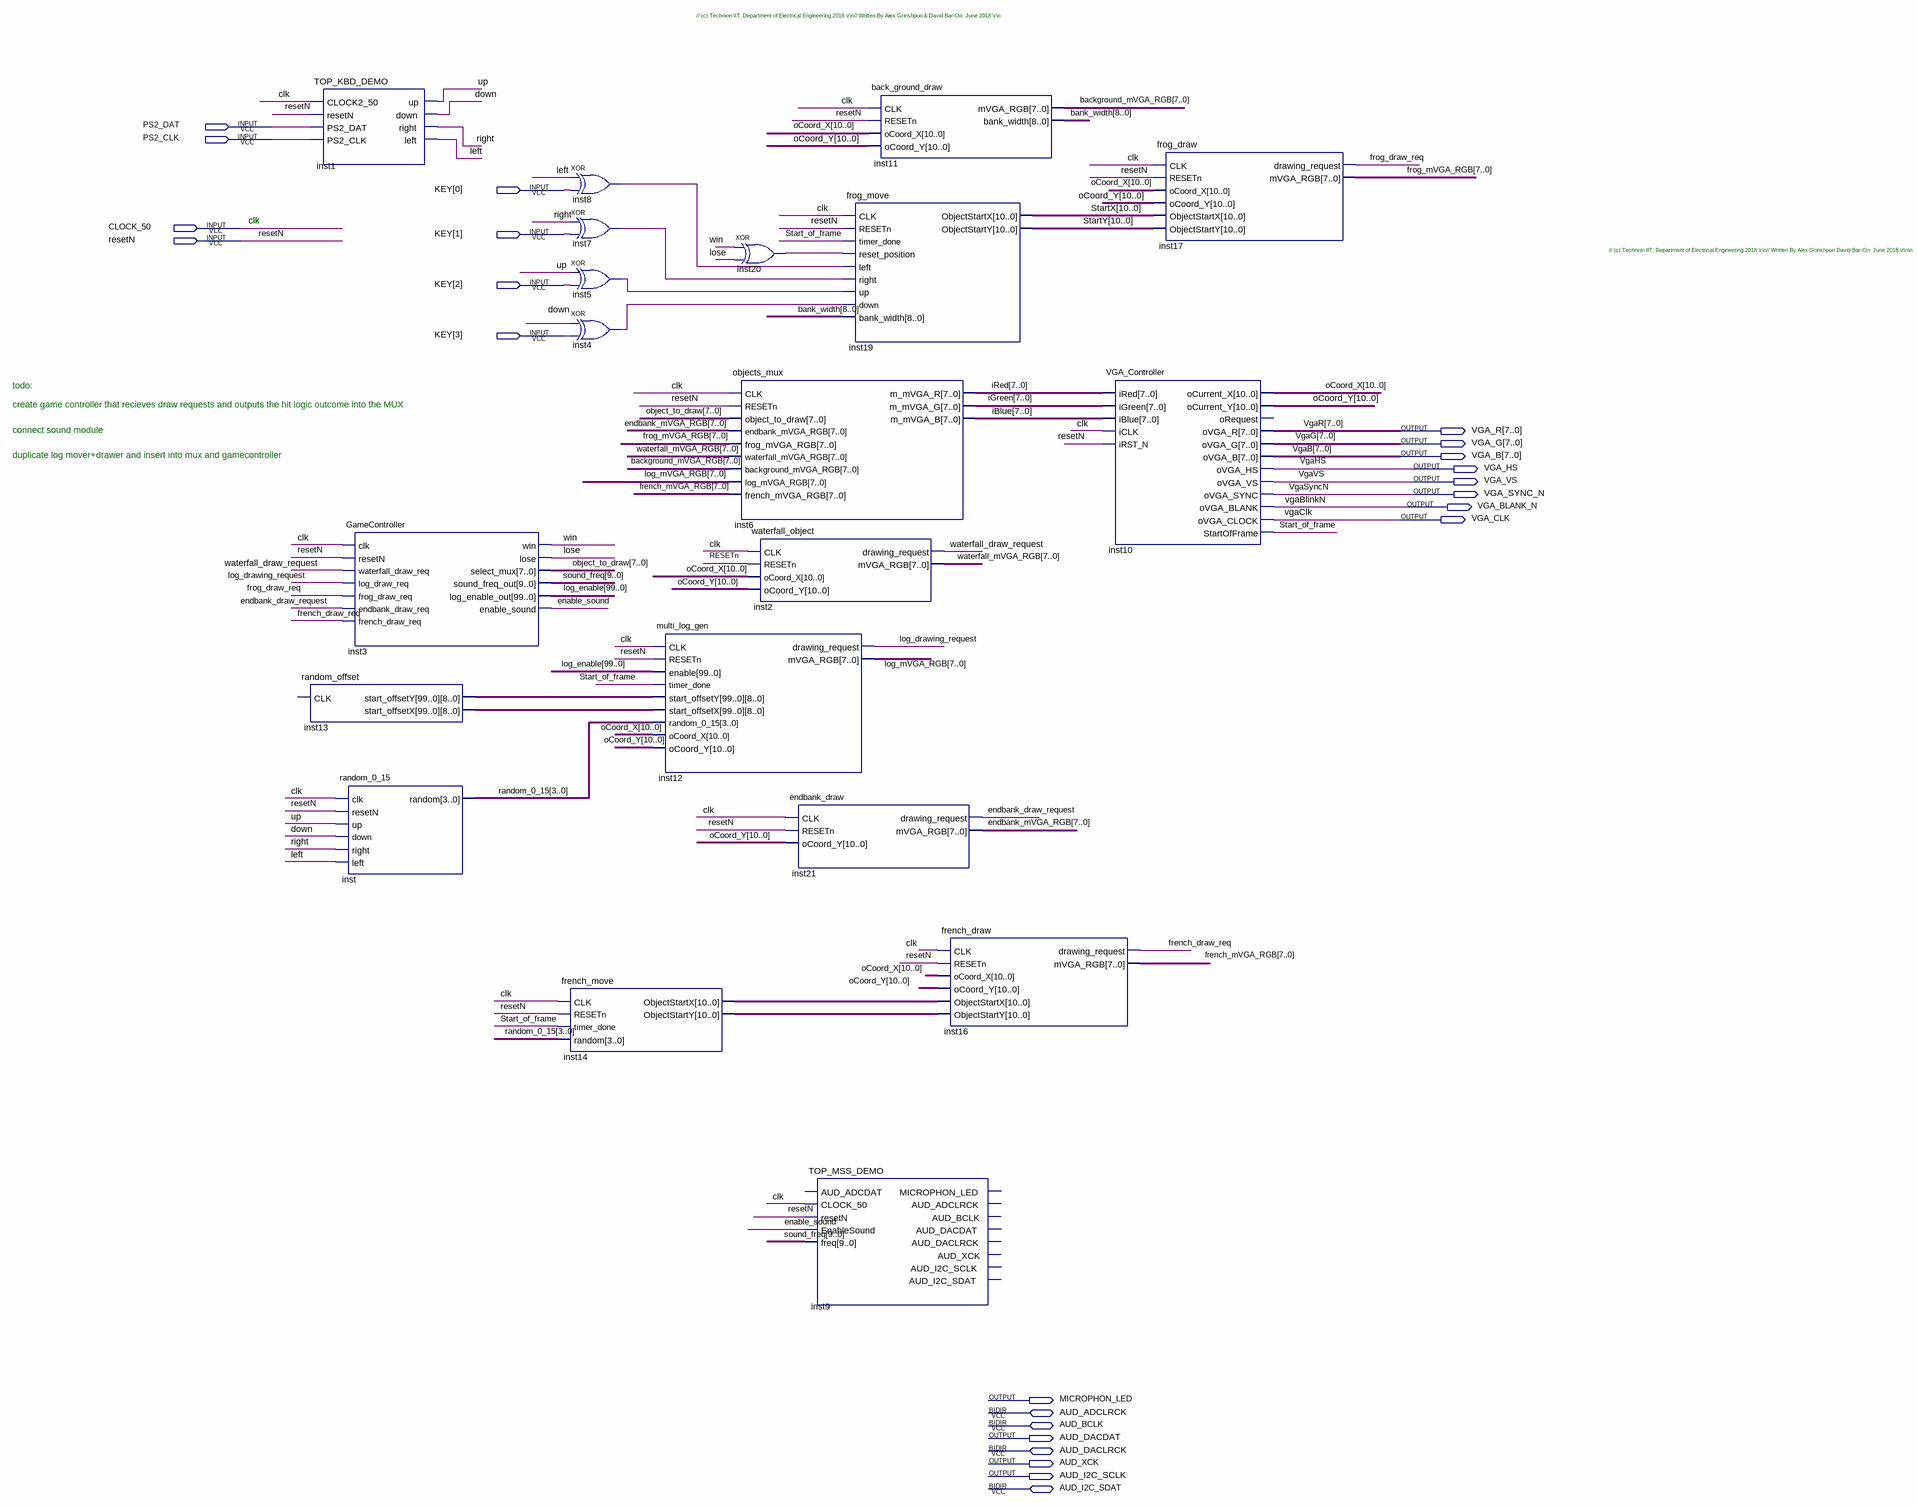
[diagram p0: schematic sheet]
// Quartus schematic frog_TOP.bdf as structural Verilog: 20 symbols, 24 pins
module frog_TOP (
  input  PS2_DAT,
  input  PS2_CLK,
  input  [3:0] KEY,
  input  CLOCK_50,
  input  resetN,
  inout  AUD_ADCLRCK,
  inout  AUD_BCLK,
  inout  AUD_DACLRCK,
  inout  AUD_I2C_SDAT,
  output [7:0] VGA_R,
  output [7:0] VGA_G,
  output [7:0] VGA_B,
  output VGA_HS,
  output VGA_VS,
  output VGA_SYNC_N,
  output VGA_BLANK_N,
  output VGA_CLK,
  output MICROPHON_LED,
  output AUD_DACDAT,
  output AUD_XCK,
  output AUD_I2C_SCLK
);

  wire down, enable_sound, endbank_draw_request, french_draw_req, frog_draw_req, inst4_out, inst5_out,
       inst7_out, inst8_out, inst20_out, left, log_drawing_request, lose, right, Start_of_frame, up,
       waterfall_draw_request, win;
  wire [3:0] random_0_15;
  wire [7:0] background_mVGA_RGB, endbank_mVGA_RGB, french_mVGA_RGB, frog_mVGA_RGB, iBlue, iGreen, iRed,
       log_mVGA_RGB, object_to_draw, waterfall_mVGA_RGB;
  wire [8:0] bank_width;
  wire [9:0] sound_freq;
  wire [10:0] inst14_objectstartx, inst14_objectstarty, oCoord_X, oCoord_Y, StartX, StartY;
  wire [99:0] log_enable;
  wire [899:0] inst13_start_offsetx, inst13_start_offsety;

  TOP_KBD_DEMO inst1 (
    .CLOCK2_50(CLOCK_50), .resetN(resetN), .PS2_DAT(PS2_DAT), .PS2_CLK(PS2_CLK), .up(up), .down(down),
    .right(right), .left(left));
  random_offset inst13 (.start_offsetY(inst13_start_offsety), .start_offsetX(inst13_start_offsetx));  // open: CLK
  random_0_15 inst (
    .clk(CLOCK_50), .resetN(resetN), .up(up), .down(down), .right(right), .left(left), .random(random_0_15));
  GameController inst3 (
    .clk(CLOCK_50), .resetN(resetN), .waterfall_draw_req(waterfall_draw_request),
    .log_draw_req(log_drawing_request), .frog_draw_req(frog_draw_req),
    .endbank_draw_req(endbank_draw_request), .french_draw_req(french_draw_req), .win(win), .lose(lose),
    .select_mux(object_to_draw), .sound_freq_out(sound_freq), .log_enable_out(log_enable),
    .enable_sound(enable_sound));
  xor inst8 (inst8_out, left, KEY[0]);
  xor inst7 (inst7_out, right, KEY[1]);
  xor inst5 (inst5_out, up, KEY[2]);
  xor inst4 (inst4_out, down, KEY[3]);
  french_move inst14 (
    .CLK(CLOCK_50), .RESETn(resetN), .timer_done(Start_of_frame), .random(random_0_15),
    .ObjectStartX(inst14_objectstartx), .ObjectStartY(inst14_objectstarty));
  multi_log_gen inst12 (
    .CLK(CLOCK_50), .RESETn(resetN), .enable(log_enable), .timer_done(Start_of_frame),
    .start_offsetY(inst13_start_offsety), .start_offsetX(inst13_start_offsetx), .random_0_15(random_0_15),
    .oCoord_X(oCoord_X), .oCoord_Y(oCoord_Y), .drawing_request(log_drawing_request), .mVGA_RGB(log_mVGA_RGB));
  xor inst20 (inst20_out, win, lose);
  objects_mux inst6 (
    .CLK(CLOCK_50), .RESETn(resetN), .object_to_draw(object_to_draw), .endbank_mVGA_RGB(endbank_mVGA_RGB),
    .frog_mVGA_RGB(frog_mVGA_RGB), .waterfall_mVGA_RGB(waterfall_mVGA_RGB),
    .background_mVGA_RGB(background_mVGA_RGB), .log_mVGA_RGB(log_mVGA_RGB),
    .french_mVGA_RGB(french_mVGA_RGB), .m_mVGA_R(iRed), .m_mVGA_G(iGreen), .m_mVGA_B(iBlue));
  waterfall_object inst2 (
    .CLK(CLOCK_50), .RESETn(resetN), .oCoord_X(oCoord_X), .oCoord_Y(oCoord_Y),
    .drawing_request(waterfall_draw_request), .mVGA_RGB(waterfall_mVGA_RGB));
  endbank_draw inst21 (
    .CLK(CLOCK_50), .RESETn(resetN), .oCoord_Y(oCoord_Y), .drawing_request(endbank_draw_request),
    .mVGA_RGB(endbank_mVGA_RGB));
  frog_move inst19 (
    .CLK(CLOCK_50), .RESETn(resetN), .timer_done(Start_of_frame), .reset_position(inst20_out),
    .left(inst8_out), .right(inst7_out), .up(inst5_out), .down(inst4_out), .bank_width(bank_width),
    .ObjectStartX(StartX), .ObjectStartY(StartY));
  TOP_MSS_DEMO inst9 (
    .CLOCK_50(CLOCK_50), .resetN(resetN), .EnableSound(enable_sound), .freq(sound_freq));  // open: AUD_ADCDAT, MICROPHON_LED, AUD_DACDAT, AUD_XCK, AUD_I2C_SCLK, AUD_ADCLRCK, AUD_BCLK, AUD_DACLRCK, AUD_I2C_SDAT
  back_ground_draw inst11 (
    .CLK(CLOCK_50), .RESETn(resetN), .oCoord_X(oCoord_X), .oCoord_Y(oCoord_Y),
    .mVGA_RGB(background_mVGA_RGB), .bank_width(bank_width));
  french_draw inst16 (
    .CLK(CLOCK_50), .RESETn(resetN), .oCoord_X(oCoord_X), .oCoord_Y(oCoord_Y),
    .ObjectStartX(inst14_objectstartx), .ObjectStartY(inst14_objectstarty),
    .drawing_request(french_draw_req), .mVGA_RGB(french_mVGA_RGB));
  VGA_Controller inst10 (
    .iRed(iRed), .iGreen(iGreen), .iBlue(iBlue), .iCLK(CLOCK_50), .iRST_N(resetN), .oCurrent_X(oCoord_X),
    .oCurrent_Y(oCoord_Y), .oVGA_R(VGA_R), .oVGA_G(VGA_G), .oVGA_B(VGA_B), .oVGA_HS(VGA_HS),
    .oVGA_VS(VGA_VS), .oVGA_SYNC(VGA_SYNC_N), .oVGA_BLANK(VGA_BLANK_N), .oVGA_CLOCK(VGA_CLK),
    .StartOfFrame(Start_of_frame));  // open: oRequest
  frog_draw inst17 (
    .CLK(CLOCK_50), .RESETn(resetN), .oCoord_X(oCoord_X), .oCoord_Y(oCoord_Y), .ObjectStartX(StartX),
    .ObjectStartY(StartY), .drawing_request(frog_draw_req), .mVGA_RGB(frog_mVGA_RGB));

  // Other names for the same wires on the sheet: clk = CLOCK_50; VgaB[7:0] = VGA_B; vgaBlinkN = VGA_BLANK_N;
  //   vgaClk = VGA_CLK; VgaG[7:0] = VGA_G; VgaHS = VGA_HS; VgaR[7:0] = VGA_R; VgaSyncN = VGA_SYNC_N; VgaVS = VGA_VS

  // Notes on the sheet:
  //   // (c) Technion IIT, Department of Electrical Engineering 2018 \r\n// Written By Alex Grinshpun & David Bar-On  June 2018 \r\n
  //   clk
  //   // (c) Technion IIT, Department of Electrical Engineering 2018 \r\n// Written By Alex Grinshpun David Bar-On  June 2018 \r\n\n
  //   todo:
  //   create game controller that recieves draw requests and outputs the hit logic outcome into the MUX
  //   connect sound module
  //   duplicate log mover+drawer and insert into mux and gamecontroller
endmodule
